# EAGLE design DOOM_SAO (EAGLE 9.3.2)
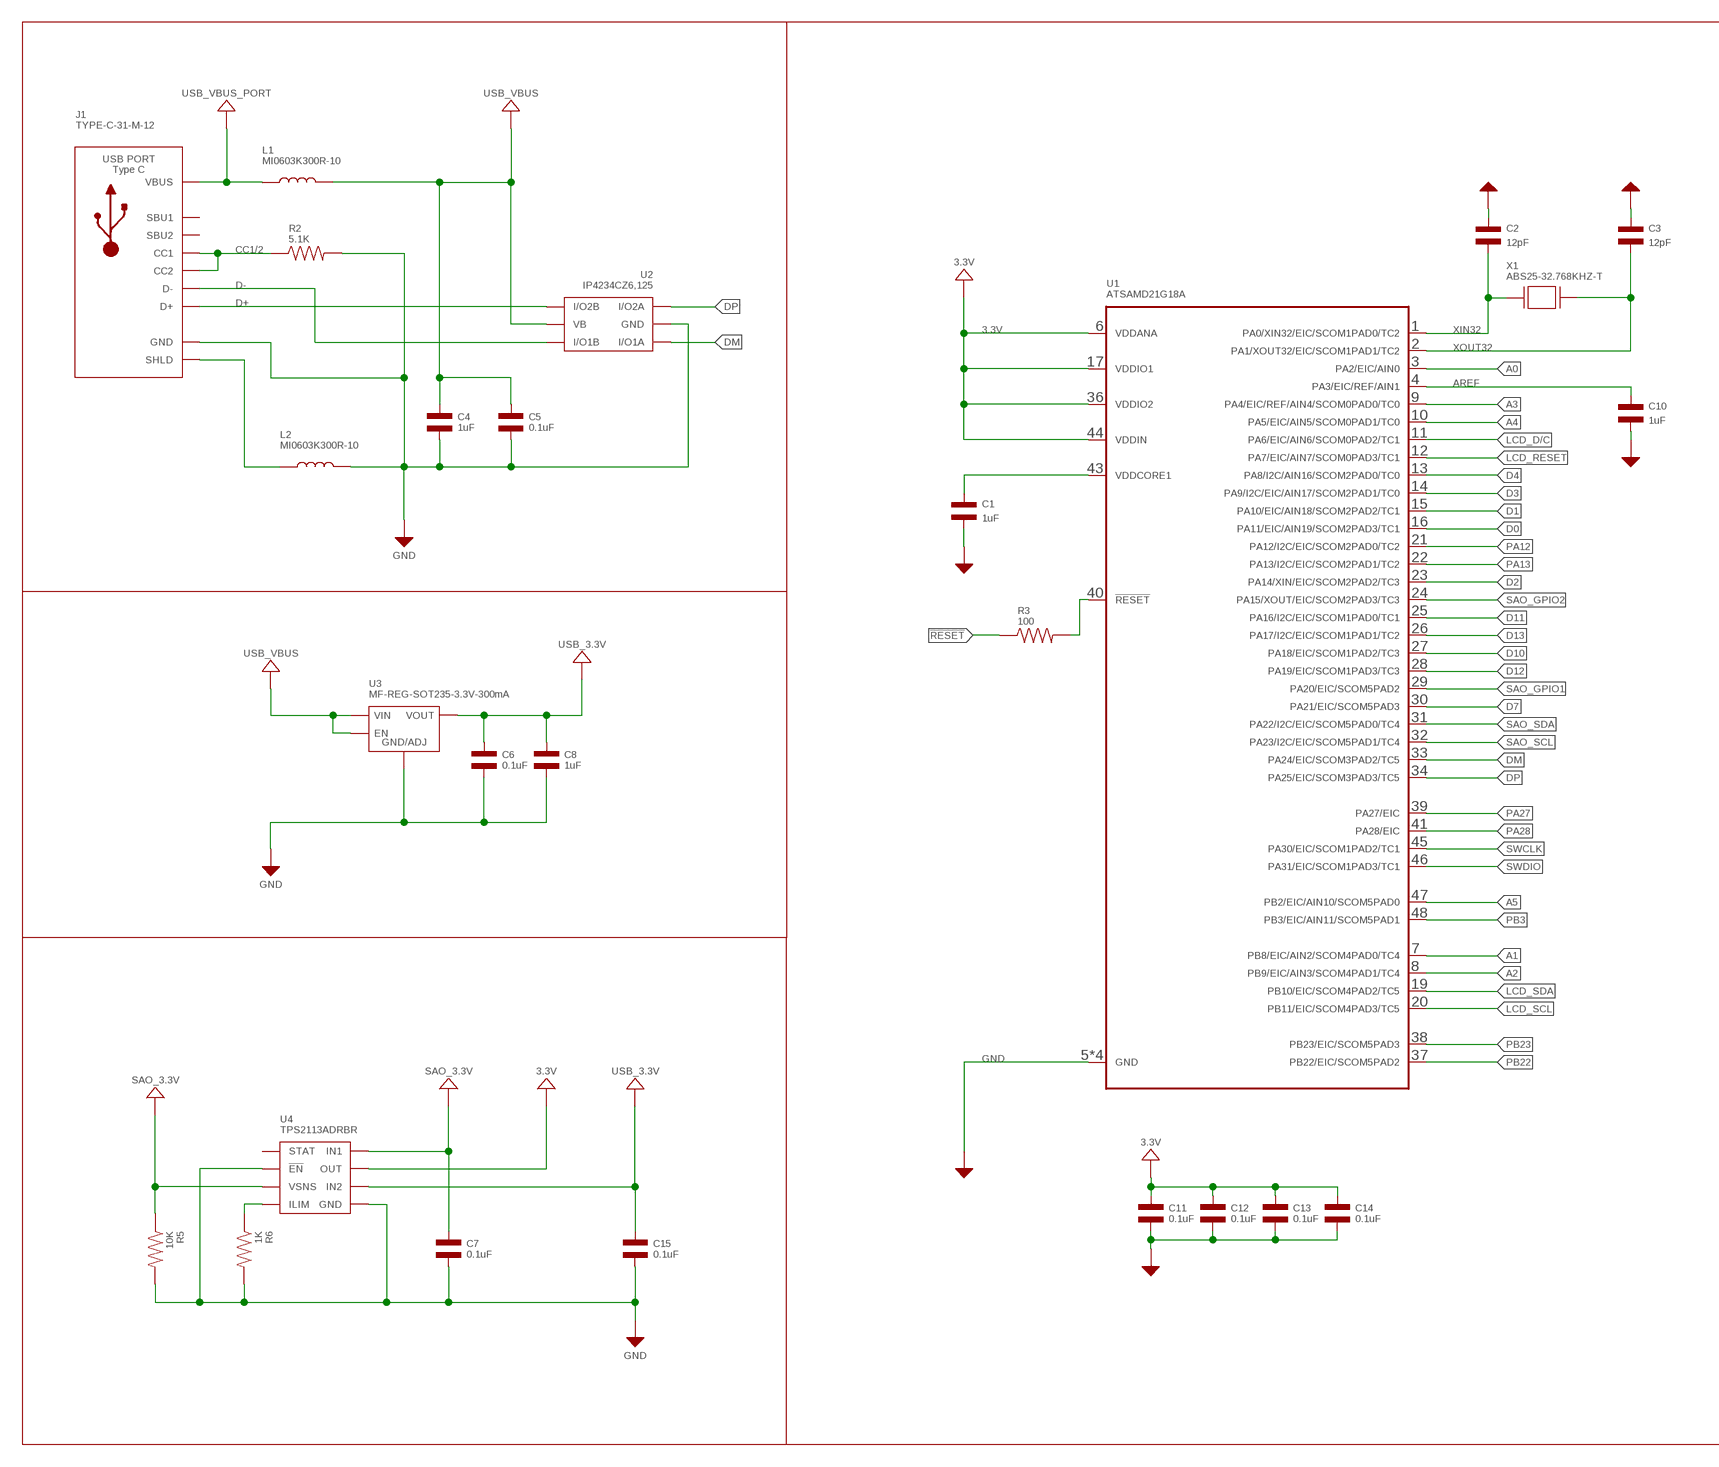
[diagram p0: schematic, sheet 1, part 1 of 2]
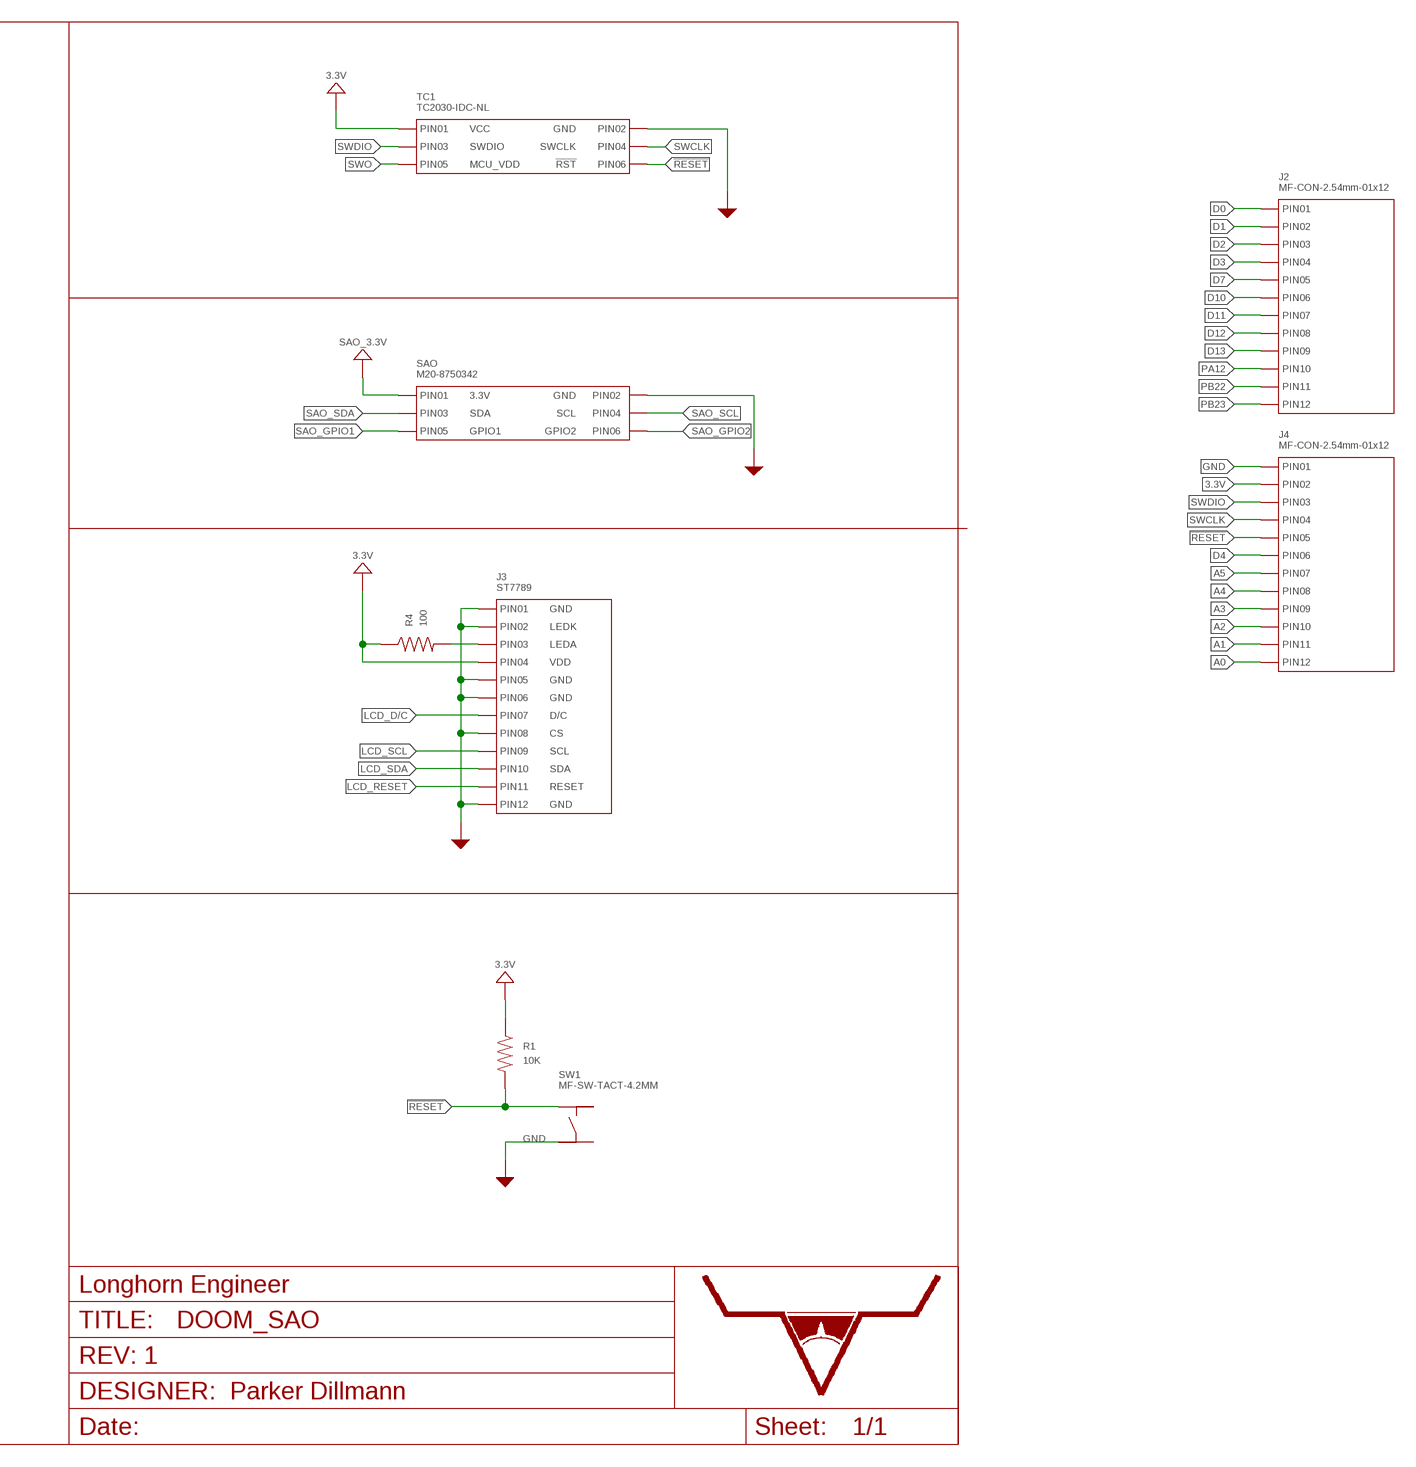
[diagram p1: schematic, sheet 1, part 2 of 2]

## Parts
C1  1uF  CAPACITOR_NP_0402  [C0402]
C2  12pF  CAPACITOR_NP_0402  [C0402]
C3  12pF  CAPACITOR_NP_0402  [C0402]
C4  1uF  CAPACITOR_NP_0402  [C0402]
C5  0.1uF  CAPACITOR_NP_0402  [C0402]
C6  0.1uF  CAPACITOR_NP_0402  [C0402]
C7  0.1uF  CAPACITOR_NP_0402  [C0402]
C8  1uF  CAPACITOR_NP_0402  [C0402]
C10  1uF  CAPACITOR_NP_0402  [C0402]
C11  0.1uF  CAPACITOR_NP_0402  [C0402]
C12  0.1uF  CAPACITOR_NP_0402  [C0402]
C13  0.1uF  CAPACITOR_NP_0402  [C0402]
C14  0.1uF  CAPACITOR_NP_0402  [C0402]
C15  0.1uF  CAPACITOR_NP_0402  [C0402]
J1  TYPE-C-31-M-12  USB_TYPE-C_MINIMAL  [TYPE-C-31-M-12]
J2  MF-CON-2.54mm-01x12  CON_01X12_PTH_2.54MM  [PTH_2.54MM_01X12]
J3  ST7789  CON_01X12_ST7789_CONNECTOR  [ST7789_CONNECTOR]
J4  MF-CON-2.54mm-01x12  CON_01X12_PTH_2.54MM  [PTH_2.54MM_01X12]
L1  MI0603K300R-10  INDUCTOR_0603  [L0603]
L2  MI0603K300R-10  INDUCTOR_0603  [L0603]
R1  10K  RESISTOR_0402  [R0402]
R2  5.1K  RESISTOR_0402  [R0402]
R3  100  RESISTOR_0402  [R0402]
R4  100  RESISTOR_0402  [R0402]
R5  10K  RESISTOR_0402  [R0402]
R6  1K  RESISTOR_0402  [R0402]
SAO  M20-8750342  CON_02X03_M20-8750342  [M20-8750342]
SW1  MF-SW-TACT-4.2MM  TACT_4.2MM  [TACT4.2MM]
TC1  TC2030-IDC-NL  CON_02X03_SWD2TC_TC2030-IDC-NL  [TC2030-IDC-NL]
U1  ATSAMD21G18A  ATSAMD21G18A-AU  [ATSAMD21G18A_TQFP-48]
U2  IP4234CZ6,125  IP4234CZ6  [IP4234CZ6_SOT-457-6]
U3  MF-REG-SOT235-3.3V-300mA  TLV70233PDBVR  [SOT-23-5]
U4  TPS2113ADRBR  TPS211(2/3)ADR  [TPS211X_SON-8]
U$8  LHE_FRAME  [LHE_FRAME]
X1  ABS25-32.768KHZ-T  CYRSTAL_ABS25  [ABS25_SERIES]

## Nets
3.3V: C11.P$1 C12.P$1 C13.P$1 C14.P$1 J3.P$4 J4.P$2(PIN2) R1.P$1 R4.P$1 TC1.P$1(PIN1) U1.6(VDDANA) U1.17(VDDIO1) U1.36(VDDIO2) U1.44(VDDIN) U4.7(OUT)
!RESET: J4.P$5(PIN5) R1.P$2 R3.P$1 SW1.P$1 TC1.P$6(PIN6)
A0: J4.P$12(PIN12) U1.3(PA2/EIC/AIN0)
A1: J4.P$11(PIN11) U1.7(PB8/EIC/AIN2/SCOM4PAD0/TC4)
A2: J4.P$10(PIN10) U1.8(PB9/EIC/AIN3/SCOM4PAD1/TC4)
A3: J4.P$9(PIN9) U1.9(PA4/EIC/REF/AIN4/SCOM0PAD0/TC0)
A4: J4.P$8(PIN8) U1.10(PA5/EIC/AIN5/SCOM0PAD1/TC0)
A5: J4.P$7(PIN7) U1.47(PB2/EIC/AIN10/SCOM5PAD0)
AREF: C10.P$1 U1.4(PA3/EIC/REF/AIN1)
BK_LIGHT: J3.P$3 R4.P$2
CC1/2: J1.A5(CC1) J1.B5(CC2) R2.P$1
D0: J2.P$1(PIN1) U1.16(PA11/EIC/AIN19/SCOM2PAD3/TC1)
D1: J2.P$2(PIN2) U1.15(PA10/EIC/AIN18/SCOM2PAD2/TC1)
D2: J2.P$3(PIN3) U1.23(PA14/XIN/EIC/SCOM2PAD2/TC3)
D3: J2.P$4(PIN4) U1.14(PA9/I2C/EIC/AIN17/SCOM2PAD1/TC0)
D4: J4.P$6(PIN6) U1.13(PA8/I2C/AIN16/SCOM2PAD0/TC0)
D7: J2.P$5(PIN5) U1.30(PA21/EIC/SCOM5PAD3)
D10: J2.P$6(PIN6) U1.27(PA18/EIC/SCOM1PAD2/TC3)
D11: J2.P$7(PIN7) U1.25(PA16/I2C/EIC/SCOM1PAD0/TC1)
D12: J2.P$8(PIN8) U1.28(PA19/EIC/SCOM1PAD3/TC3)
D13: J2.P$9(PIN9) U1.26(PA17/I2C/EIC/SCOM1PAD1/TC2)
D+: J1.A6(D+) J1.B6(D+) U2.4(I/O2B)
D-: J1.A7(D-) J1.B7(D-) U2.3(I/O1B)
DM: U1.33(PA24/EIC/SCOM3PAD2/TC5) U2.1(I/O1A)
DP: U1.34(PA25/EIC/SCOM3PAD3/TC5) U2.6(I/O2A)
GND: C1.P$2 C2.P$1 C3.P$1 C4.P$2 C5.P$2 C6.P$2 C7.P$2 C8.P$2 C10.P$2 C11.P$2 C12.P$2 C13.P$2 C14.P$2 C15.P$2 J1.A1/B12(GND) J1.B1/A12(GND) J3.P$1 J3.P$2 J3.P$5 J3.P$6 J3.P$8 J3.P$12 J4.P$1(PIN1) L2.P$2 R2.P$2 R5.P$2 R6.P$2 SAO.2(PIN2) SW1.P$3 TC1.P$2(PIN2) U1.5(GND) U1.18(GND) U1.35(GND) U1.42(GND) U2.2(GND) U3.P$2(GND/ADJ) U4.2(!EN) U4.5(GND) U4.PAD(GND)
LCD_D/C: J3.P$7 U1.11(PA6/EIC/AIN6/SCOM0PAD2/TC1)
LCD_RESET: J3.P$11 U1.12(PA7/EIC/AIN7/SCOM0PAD3/TC1)
LCD_SCL: J3.P$9 U1.20(PB11/EIC/SCOM4PAD3/TC5)
LCD_SDA: J3.P$10 U1.19(PB10/EIC/SCOM4PAD2/TC5)
PA12: J2.P$10(PIN10) U1.21(PA12/I2C/EIC/SCOM2PAD0/TC2)
PA13: U1.22(PA13/I2C/EIC/SCOM2PAD1/TC2)
PA27: U1.39(PA27/EIC)
PA28: U1.41(PA28/EIC)
PB3: U1.48(PB3/EIC/AIN11/SCOM5PAD1)
PB22: J2.P$11(PIN11) U1.37(PB22/EIC/SCOM5PAD2)
PB23: J2.P$12(PIN12) U1.38(PB23/EIC/SCOM5PAD3)
RESETLIN: R3.P$2 U1.40(!RESET)
SAO_3.3V: C7.P$1 R5.P$1 SAO.1(PIN1) U4.3(VSNS) U4.8(IN1)
SAO_GPIO1: SAO.5(PIN5) U1.29(PA20/EIC/SCOM5PAD2)
SAO_GPIO2: SAO.6(PIN6) U1.24(PA15/XOUT/EIC/SCOM2PAD3/TC3)
SAO_SCL: SAO.4(PIN4) U1.32(PA23/I2C/EIC/SCOM5PAD1/TC4)
SAO_SDA: SAO.3(PIN3) U1.31(PA22/I2C/EIC/SCOM5PAD0/TC4)
SHLD: J1.MT_B_0(SHLD) J1.MT_B_1(SHLD) J1.MT_B_2(SHLD) J1.MT_B_3(SHLD) J1.MT_T_0(SHLD) J1.MT_T_1(SHLD) J1.MT_T_2(SHLD) J1.MT_T_3(SHLD) L2.P$1
SWCLK: J4.P$4(PIN4) TC1.P$4(PIN4) U1.45(PA30/EIC/SCOM1PAD2/TC1)
SWDIO: J4.P$3(PIN3) TC1.P$3(PIN3) U1.46(PA31/EIC/SCOM1PAD3/TC1)
SWO: TC1.P$5(PIN5)
TPS_ILIM: R6.P$1 U4.4(ILIM)
USB_3.3V: C6.P$1 C8.P$1 C15.P$1 U3.P$5(VOUT) U4.6(IN2)
USB_VBUS: C4.P$1 C5.P$1 L1.P$2 U2.5(VB) U3.P$1(VIN) U3.P$3(EN)
USB_VBUS_PORT: J1.A4/B9(VBUS) J1.B4/A9(VBUS) L1.P$1
VDDCORE: C1.P$1 U1.43(VDDCORE1)
XIN32: C2.P$2 U1.1(PA0/XIN32/EIC/SCOM1PAD0/TC2) X1.1(X0)
XOUT32: C3.P$2 U1.2(PA1/XOUT32/EIC/SCOM1PAD1/TC2) X1.4(X1)
Unconnected: J1.A8(SBU1) J1.B8(SBU2) SW1.P$2 SW1.P$4 U4.1(STAT)

## Library data of the parts
C1 C4 C8 C10 = MF_Passives:CAPACITOR_NP: Library: MF_Passives Description: Device for Non-Polarized Capacitors. Manufacture part number (MPN) can be added via Attributes. Check https://factory.macrofab.com/parts for the house parts list.; MPN: MF-CAP-0402-1uF; POPULATE: 1
C2 C3 = MF_Passives:CAPACITOR_NP: Library: MF_Passives Description: Device for Non-Polarized Capacitors. Manufacture part number (MPN) can be added via Attributes. Check https://factory.macrofab.com/parts for the house parts list.; MPN: CC0402JRNPO9BN120; POPULATE: 1
C5-C7 C11-C15 = MF_Passives:CAPACITOR_NP: Library: MF_Passives Description: Device for Non-Polarized Capacitors. Manufacture part number (MPN) can be added via Attributes. Check https://factory.macrofab.com/parts for the house parts list.; MPN: MF-CAP-0402-0.1uF; POPULATE: 1
J1 = PP_Connectors:USB_TYPE-C_MINIMAL; MPN: TYPE-C-31-M-12; POPULATE: 1
J2 J4 = MF_Connectors:CON_01X12: Library: MF_Connectors Description: Header Connector with 12 Positions and 01 Rows. Use the LABEL Attribute to label the pin on the schematic and PCB. You can remove the attributes on the PCB by using the SMASH function on the part and then deleting the text.; HOUSEPART: YES; MPN: MF-CON-2.54mm-01x12; POPULATE: 1; URL: https://factory.macrofab.com/part/MF-CON-2.54mm-01x12
J3 = PP_Connectors:CON_01X12; LABEL01: GND; LABEL02: LEDK; LABEL03: LEDA; LABEL04: VDD; LABEL05: GND; LABEL06: GND; LABEL07: D/C; LABEL08: CS; LABEL09: SCL; LABEL10: SDA; LABEL11: RESET; LABEL12: GND; POPULATE: 0
L1 L2 = MF_Passives:INDUCTOR: Library: MF_Passives Description: Device for Inductors. Manufacture part number (MPN) can be added via Attributes. Check https://factory.macrofab.com/parts for the house parts list.; MPN: MI0603K300R-10; POPULATE: 1
R1 R5 = MF_Passives:RESISTOR: Library: MF_Passives Description: Device for Resistors. Manufacture part number (MPN), Voltage, Tolerance, and Wattage Rating can be added via Attributes. Check https://factory.macrofab.com/parts for the house parts list.; MPN: MF-RES-0402-10K; POPULATE: 1
R2 = MF_Passives:RESISTOR: Library: MF_Passives Description: Device for Resistors. Manufacture part number (MPN), Voltage, Tolerance, and Wattage Rating can be added via Attributes. Check https://factory.macrofab.com/parts for the house parts list.; MPN: ERJ-2RHD5101X; POPULATE: 1
R3 R4 = MF_Passives:RESISTOR: Library: MF_Passives Description: Device for Resistors. Manufacture part number (MPN), Voltage, Tolerance, and Wattage Rating can be added via Attributes. Check https://factory.macrofab.com/parts for the house parts list.; MPN: MF-RES-0402-100; POPULATE: 1
R6 = MF_Passives:RESISTOR: Library: MF_Passives Description: Device for Resistors. Manufacture part number (MPN), Voltage, Tolerance, and Wattage Rating can be added via Attributes. Check https://factory.macrofab.com/parts for the house parts list.; MPN: MF-RES-0402-1K; POPULATE: 1
SAO = PP_Connectors:CON_02X03; LABEL01: 3.3V; LABEL02: GND; LABEL03: SDA; LABEL04: SCL; LABEL05: GPIO1; LABEL06: GPIO2; MPN: M20-8750342; POPULATE: 1
SW1 = MF_Switches:TACT: Library: MF_Switches Description: Device for Tact Switches. Manufacture part number (MFG#) can be added via Attributes.; HOUSEPART: YES; MPN: MF-SW-TACT-4.2MM; POPULATE: 1; URL: https://factory.macrofab.com/part/MF-SW-TACT-4.2MM
TC1 = MF_Connectors:CON_02X03: Library: MF_Connectors Description: Header Connector with 6 Positions and 02 Rows. Use the LABEL Attribute to label the pin on the schematic and PCB. You can remove the attributes on the PCB by using the SMASH function on the part and then deleting the text.; HOUSEPART: NO; LABEL01: VCC; LABEL02: GND; LABEL03: SWDIO; LABEL04: SWCLK; LABEL05: MCU_VDD; LABEL06: !RST; MPN: TC2030-IDC-NL; POPULATE: 0; URL: http://www.tag-connect.com/TC2030-IDC-NL
U1 = PP_DigitalIC:ATSAMD21G18A; MPN: ATSAMD21G18A-AU; POPULATE: 1
U2 = PP_Passives:IP4234CZ6: Mouser Part #: 771-IP4234CZ6125 Manufacturer Part #: IP4234CZ6,125 Manufacturer: NXP Semiconductors Description: ESD Suppressors Single USB 2.0 ESD Protection 6-Pin http://www.mouser.com/ProductDetail/NXP-Semiconductors/IP4234CZ6125/?qs=sGAEpiMZZMvxHShE6Whpu7QUdHOfUl1T0xbl582qhFk%3d; MPN: IP4234CZ6,125; POPULATE: 1
U3 = MF_IC_Power:TLV702: Manufacturer Part #: TLV702 Manufacturer: Texas Instruments Description: LDO Voltage Regulators; HOUSEPART: YES; MPN: MF-REG-SOT235-3.3V-300mA; POPULATE: 1; URL: https://factory.macrofab.com/part/MF-REG-SOT235-3.3V-300mA
U4 = PP_PowerIC:TPS211(2/3): Manufacturer Part #: TPS2112 / TPS2113 Manufacturer: Texas Instruments Description: Power Switch ICs - Power Distribution Autoswitching Power Mux
U$8 = PP_Aesthetics:LHE_FRAME; DNAME: Parker Dillmann; POPULATE: 0; REVNUM: REV: 1
X1 = MF_Frequency_Control:CYRSTAL: Library: MF_Frequency_Control Description: Device for two functional pin Cyrstal Oscillators.; HOUSEPART: NO; MPN: ABS25-32.768KHZ-T; POPULATE: 1; URL: http://www.abracon.com/Resonators/abs25.pdf

## Board
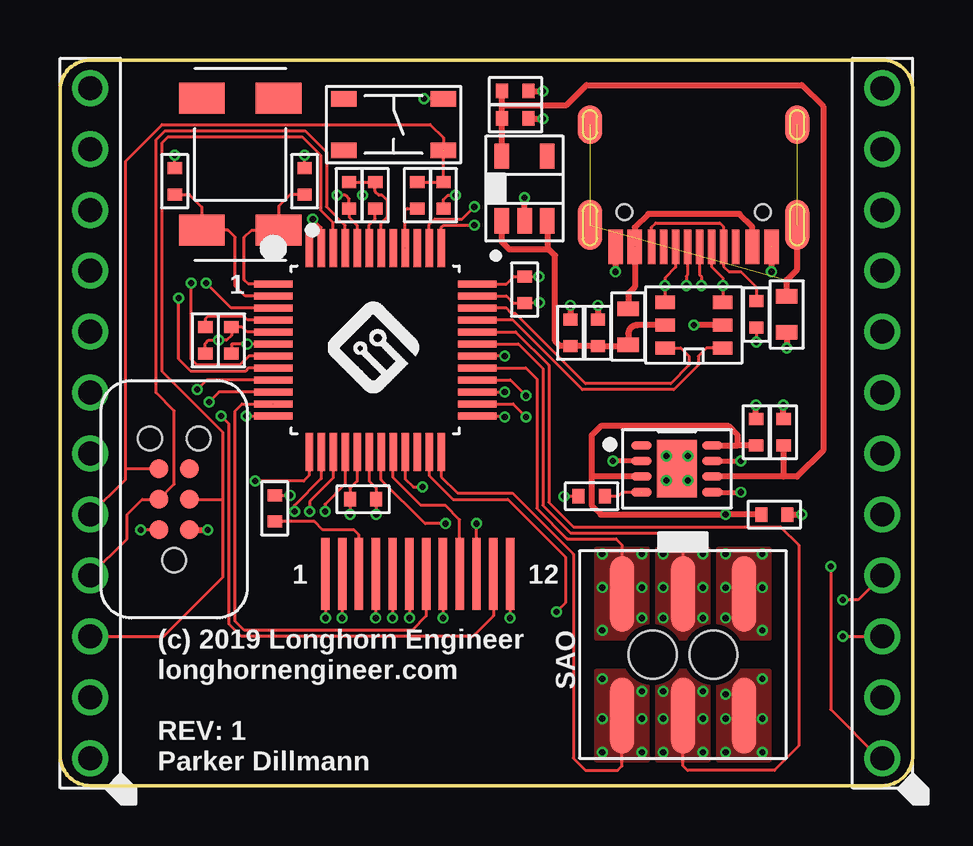
[diagram p2: board, top side]
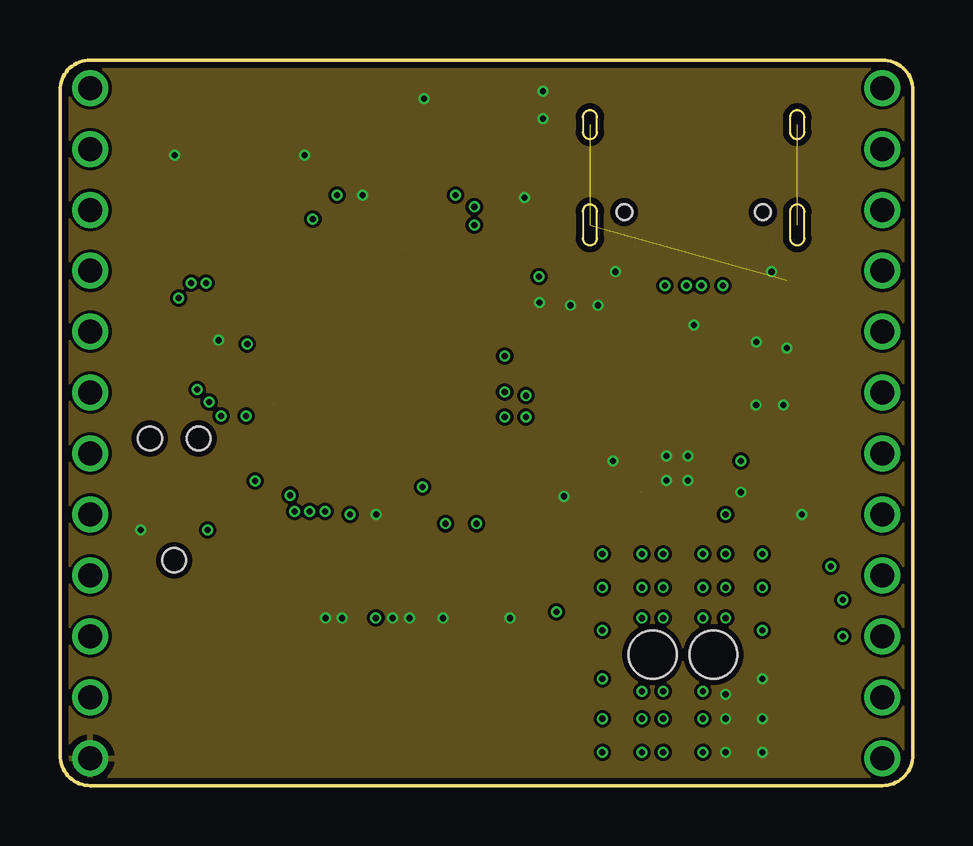
[diagram p3: board, inner layer Route2]
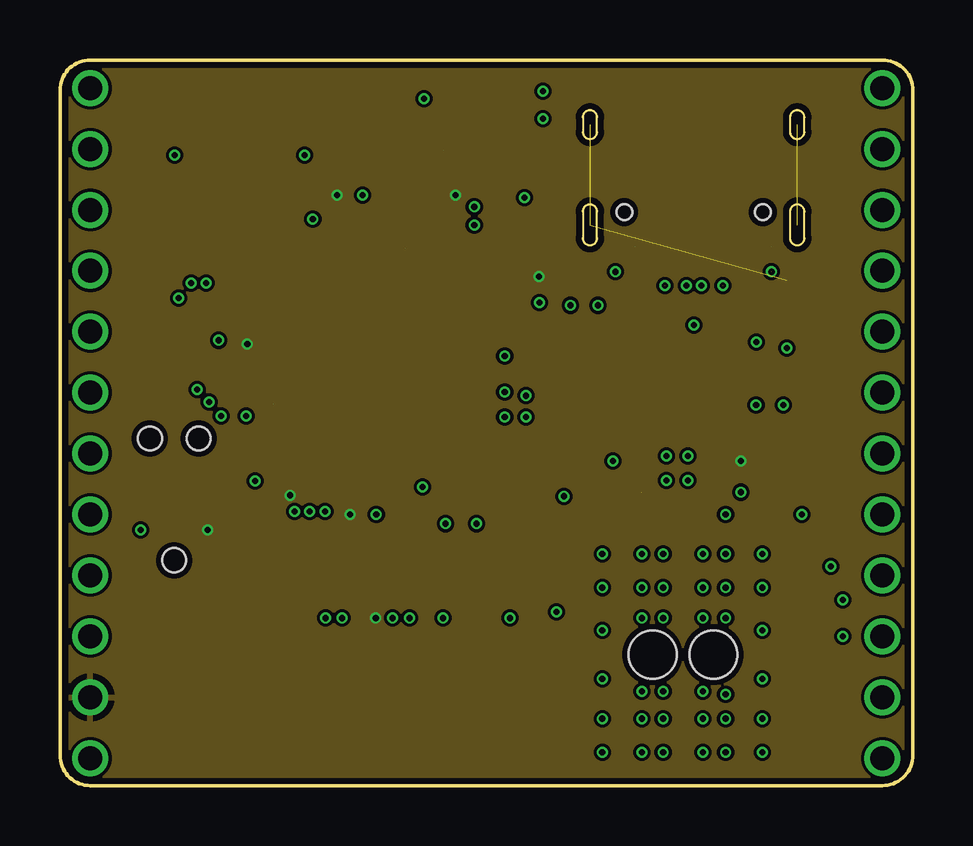
[diagram p4: board, inner layer Route15]
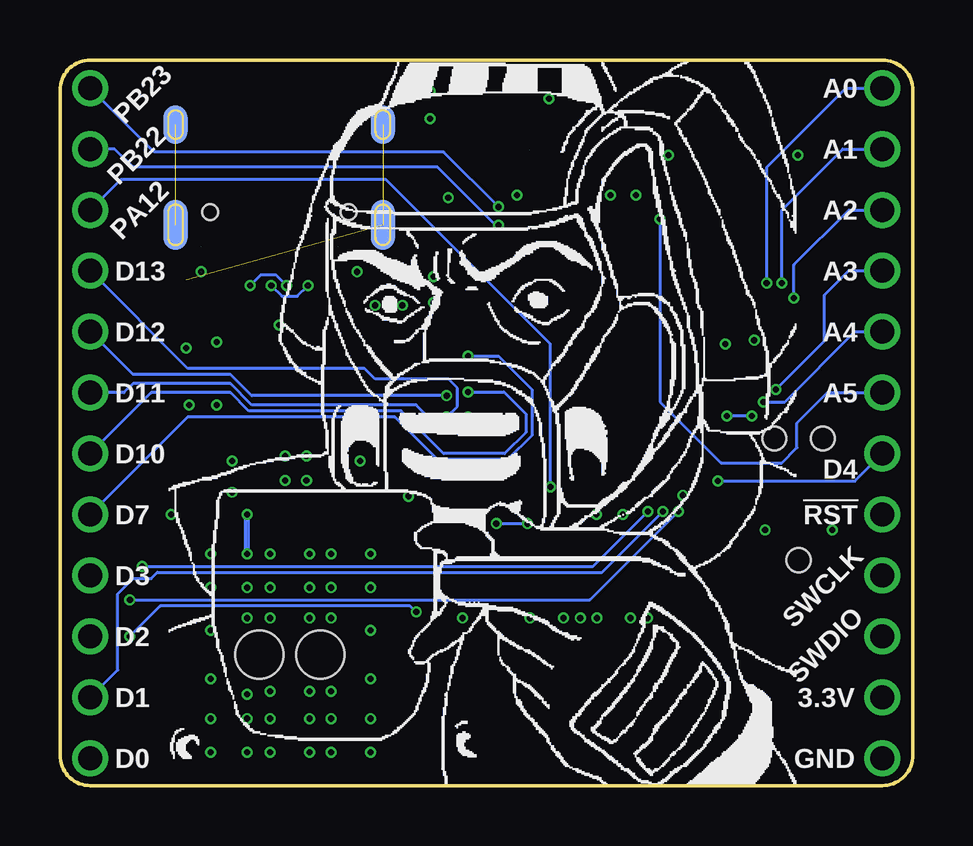
[diagram p5: board, bottom side, seen from below]

Size 35.55 x 30.25 mm. Coordinates in mm from the lower left corner, seen from the top.
Outline: 0,28.98 0,1.27 arc90 1.27,0 34.28,0 arc90 35.55,1.27 35.55,28.98 arc90 34.28,30.25 1.27,30.25 arc90 0,28.98
Copper layers (1*2*15*16): Top 0.035mm / dielectric 0.23mm / Route2 0.035mm / dielectric 0.93mm / Route15 0.035mm / dielectric 0.23mm / Bottom 0.035mm
Design rules "MF_Standard_4_Layer": minimum track width 5mil, minimum drill 10mil, track to track 5mil, track to pad 5mil, pad to pad 5mil, via to via 5mil, smd to smd 0mil, copper to edge 10mil, drill to drill 10mil, minimum pad ring 4mil, minimum via ring 4mil, stop-mask expansion 2mil, vias tented up to drill 25mil, thermal gap 10mil

### Footprints (pad centres in the part's own frame; a part is rotated, then mirrored left to right if it is on the bottom)
C0402 = smd 0.5 x 0.6: P$1 -0.55,0; P$2 0.55,0
TYPE-C-31-M-12 = smd 0.6 x 1.45: A1/B12 -3.25,5.095; A4/B9 -2.45,5.095; B1/A12 3.25,5.095; B4/A9 2.45,5.095 | smd 0.3 x 1.45: A5 -1.25,5.095; A6 -0.25,5.095; A7 0.25,5.095; A8 1.25,5.095; B5 1.75,5.095; B6 0.75,5.095; B7 -0.75,5.095; B8 -1.75,5.095 | smd 1 x 2.1 bottom: MT_B_0 -4.32,4.18; MT_B_1 4.32,4.18 | smd 1 x 1.6 bottom: MT_B_2 -4.32,0; MT_B_3 4.32,0 | smd 1 x 2.1: MT_T_0 -4.32,4.18; MT_T_1 4.32,4.18 | smd 1 x 1.6: MT_T_2 -4.32,0; MT_T_3 4.32,0 | hole 0.65: -2.89,3.65; 2.89,3.65
PTH_2.54MM_01X12 = drill 1: P$1 -13.97,0; P$2 -11.43,0; P$3 -8.89,0; P$4 -6.35,0; P$5 -3.81,0; P$6 -1.27,0; P$7 1.27,0; P$8 3.81,0; P$9 6.35,0; P$10 8.89,0; P$11 11.43,0; P$12 13.97,0
ST7789_CONNECTOR = smd 0.35 x 3: P$1 -3.85,0; P$2 -3.15,0; P$3 -2.45,0; P$4 -1.75,0; P$5 -1.05,0; P$6 -0.35,0; P$7 0.35,0; P$8 1.05,0; P$9 1.75,0; P$10 2.45,0; P$11 3.15,0; P$12 3.85,0
L0603 = smd 0.6 x 0.9: P$1 -0.75,0; P$2 0.75,0
R0402 = smd 0.5 x 0.6: P$1 -0.55,0; P$2 0.55,0
M20-8750342 = smd 1 x 3.15: 1 -2.54,-2.54; 2 -2.54,2.54; 3 0,-2.54; 4 0,2.54; 5 2.54,-2.54; 6 2.54,2.54 | hole 2: -1.27,0; 1.27,0
TACT4.2MM = smd 1.05 x 0.65: P$1 -2.075,1.075; P$2 2.075,1.075; P$3 -2.075,-1.075; P$4 2.075,-1.075
TC2030-IDC-NL = smd 0.787 x 0.787: P$1 -1.27,-0.635; P$2 -1.27,0.635; P$3 0,-0.635; P$4 0,0.635; P$5 1.27,-0.635; P$6 1.27,0.635 | hole 0.991: 2.54,1.016; 2.54,-1.016; -2.54,0
ATSAMD21G18A_TQFP-48 = smd 1.6 x 0.3: 1 -4.25,2.75; 2 -4.25,2.25; 3 -4.25,1.75; 4 -4.25,1.25; 5 -4.25,0.75; 6 -4.25,0.25; 7 -4.25,-0.25; 8 -4.25,-0.75; 9 -4.25,-1.25; 10 -4.25,-1.75; 11 -4.25,-2.25; 12 -4.25,-2.75; 25 4.25,-2.75; 26 4.25,-2.25; 27 4.25,-1.75; 28 4.25,-1.25; 29 4.25,-0.75; 30 4.25,-0.25; 31 4.25,0.25; 32 4.25,0.75; 33 4.25,1.25; 34 4.25,1.75; 35 4.25,2.25; 36 4.25,2.75 | smd 0.3 x 1.6: 13 -2.75,-4.25; 14 -2.25,-4.25; 15 -1.75,-4.25; 16 -1.25,-4.25; 17 -0.75,-4.25; 18 -0.25,-4.25; 19 0.25,-4.25; 20 0.75,-4.25; 21 1.25,-4.25; 22 1.75,-4.25; 23 2.25,-4.25; 24 2.75,-4.25; 37 2.75,4.25; 38 2.25,4.25; 39 1.75,4.25; 40 1.25,4.25; 41 0.75,4.25; 42 0.25,4.25; 43 -0.25,4.25; 44 -0.75,4.25; 45 -1.25,4.25; 46 -1.75,4.25; 47 -2.25,4.25; 48 -2.75,4.25
IP4234CZ6_SOT-457-6 = smd 0.8 x 0.55: 1 -1.2,0.95; 2 -1.2,0; 3 -1.2,-0.95; 4 1.2,-0.95; 5 1.2,0; 6 1.2,0.95
SOT-23-5 = smd 1.05 x 0.6: P$1 -1.35,0.95; P$2 -1.35,0; P$3 -1.35,-0.95; P$4 1.35,-0.95; P$5 1.35,0.95
TPS211X_SON-8 = smd 0.35 x 0.85: 1 -0.975,-1.475; 2 -0.325,-1.475; 3 0.325,-1.475; 4 0.975,-1.475; 5 0.975,1.475; 6 0.325,1.475; 7 -0.325,1.475; 8 -0.975,1.475 | smd 2.4 x 1.65: PAD 0,0
ABS25_SERIES = smd 1.9 x 1.3: 1 -1.6,2.75; 2 -1.6,-2.75; 3 1.6,-2.75; 4 1.6,2.75

### Placement (x,y rotation side)
C1  13.14,24.61 90 top
C2  10.2,25.2 270 top
C3  4.79,25.2 270 top
C4  21.28,18.88 90 top
C5  22.43,18.88 90 top
C6  18.99,27.81 0 top
C7  29.02,14.73 90 top
C8  18.99,28.96 0 top
C10  6.06,18.57 270 top
C11  7.15,18.57 90 top
C12  12.64,11.94 0 top
C13  19.37,20.68 270 top
C14  12.05,24.61 90 top
C15  30.16,14.73 90 top
J1  26.41,27.56 180 top
J2  34.29,15.11 90 top
J3  14.92,8.83 0 top
J4  1.27,15.11 90 top
L1  23.7,19.14 270 top
L2  30.3,19.64 270 top
R1  15.99,24.61 90 top
R2  29.03,19.64 270 top
R3  14.9,24.61 270 top
R4  8.95,11.56 270 top
R5  29.78,11.3 0 top
R6  22.16,12.06 180 top
SAO  25.97,5.46 180 top
SW1  13.91,27.56 180 top
TC1  4.76,11.94 90 top
U1  13.14,18.16 0 top
U2  26.43,19.2 180 top
U3  19.37,24.89 90 top
U4  25.72,13.21 270 top
U$8  4.06,0.64 0 top
U$9  [MF_LOGO_SMALL]  11.18,16.38 0 top
X1  7.52,25.91 180 top

### Tracks (layer width: path | path; a pad name or v marks a point on that pad's centre or on a via)
3.3V  (via drill 0.25)
  Top 0.127: U1.17 12.39,12.7 12.09,12.39 C12.P$1 v12.09,11.3 | U1.36 18.61,20.91 18.92,21.23 C13.P$1 v19.98,21.23 | U1.44 12.39,23.36 12.05,23.7 C14.P$1 12.05,24.46 11.9,24.61 v11.54,24.61 | R1.P$1 15.99,24.43 16.17,24.61 v16.5,24.61 | U1.6 v7.81,18.41 7.18,18.41 7.15,18.39 C11.P$1 | J3.P$4 v13.17,6.99 | R4.P$1 v9.59,12.11
  Top 0.2: U4.7 v28.38,13.53
  Top 0.254: TC1.P$1 v6.16,10.67
  pour Route15: 0,1.27 0,28.98 arc-90 1.27,30.25 34.28,30.25 arc-90 35.55,28.98 35.55,1.27 arc-90 34.28,0 1.27,0 arc-90
!RESET  (1 unrouted)
  Top 0.127: R3.P$1 R1.P$2 SW1.P$1 15.98,27.01 15.43,27.56 4.25,27.56 2.73,26.04 2.73,13.21 | J4.P$5 2.73,12.76 2.73,13.21 | TC1.P$6 2.73,13.21
A0  (via drill 0.25)
  Top 0.127: U1.3 7.14,19.91 v6.1,20.95
  Bottom 0.127: v6.1,20.95 6.1,25.78 2.79,29.08 J4.P$12
A1  (via drill 0.25)
  Top 0.127: U1.7 7.88,17.91 7.49,17.53 5.71,17.53 5.46,17.78 v5.46,20.95
  Bottom 0.127: v5.46,20.95 5.46,24 2.92,26.54 J4.P$11
A2  (via drill 0.25)
  Top 0.127: U1.8 7.87,17.41 7.74,17.27 5.46,17.27 4.95,17.78 v4.95,20.32
  Bottom 0.127: v4.95,20.32 4.95,21.72 2.67,24 J4.P$10
A3  (via drill 0.25)
  Top 0.127: U1.9 6.12,16.91 v5.71,16.51
  Bottom 0.127: v5.71,16.51 3.68,18.54 3.68,20.45 2.67,21.46 J4.P$9
A4  (via drill 0.25)
  Top 0.127: U1.10 6.63,16.41 v6.22,16
  Bottom 0.127: v6.22,16 5.33,16 2.41,18.92 J4.P$8
A5  (via drill 0.25)
  Top 0.127: U1.47 10.89,23.27 v10.54,23.62
  Bottom 0.127: v10.54,23.62 10.54,16 8,13.46 5.46,13.46 4.83,14.1 4.83,15.11 3.56,16.38 J4.P$7
AREF
  Top 0.127: U1.4 7.83,19.41 7.68,19.56 6.16,19.56 6.06,19.46 C10.P$1
BK_LIGHT
  Top 0.127: J3.P$3 12.47,10.46 12.26,10.67 10.94,10.67 10.6,11.01 R4.P$2
CC1/2
  Top 0.127: J1.B5 24.66,23.28 24.84,23.45 27.51,23.45 27.66,23.3 J1.A5 27.66,21.64 27.89,21.42 28.39,21.42 29.03,20.79 R2.P$1
D0  (via drill 0.25)
  Top 0.127: U1.16 11.89,12.57 11.05,11.73 v11.05,11.43 | v32.13,9.14 32.13,3.17 34.16,1.14 J2.P$1
  Bottom 0.127: v32.13,9.14 13.34,9.14 v11.05,11.43
D1  (via drill 0.25)
  Top 0.127: U1.15 11.39,12.83 10.41,11.85 v10.41,11.43
  Bottom 0.127: J2.P$2 33.15,4.83 33.15,8 32.51,8.64 31.75,8.64 31.5,8.89 12.95,8.89 v10.41,11.43
D2  (via drill 0.25)
  Top 0.127: U1.23 15.39,12.93 16.38,11.94 18.67,11.94 21.08,9.53 21.08,7.62 v20.7,7.24 | v32.64,6.22 J2.P$3
  Bottom 0.127: v20.7,7.24 20.95,7.49 31.37,7.49 v32.64,6.22
D3  (via drill 0.25)
  Top 0.127: U1.14 10.89,12.8 9.78,11.68 v9.78,11.43 | J2.P$4 33.27,7.75 v32.64,7.75
  Bottom 0.127: v32.64,7.75 13.46,7.75 v9.78,11.43
D4  (via drill 0.25)
  Top 0.127: U1.13 10.39,12.93 10.16,12.7 v8.13,12.7
  Bottom 0.127: v8.13,12.7 2.41,12.7 J4.P$6
D7  (via drill 0.25)
  Top 0.127: v18.54,17.91 U1.30
  Bottom 0.127: v18.54,17.91 17.27,17.91 15.88,16.51 15.88,14.61 16.89,13.59 19.81,13.59 21.59,15.37 30.23,15.37 J2.P$5
D10  (via drill 0.25)
  Top 0.127: U1.27 v18.54,16.41
  Bottom 0.127: v18.54,16.41 17.05,16.41 16.13,15.49 16.13,14.73 17.02,13.84 19.56,13.84 21.34,15.62 27.69,15.62 28.45,16.38 31.75,16.38 J2.P$6
D11  (via drill 0.25)
  Top 0.127: U1.25 18.54,15.41 v18.54,15.37
  Bottom 0.127: v18.54,15.37 19.05,14.86 19.68,14.86 20.7,15.88 27.56,15.88 28.45,16.76 32.51,16.76 32.89,16.38 J2.P$7
D12  (via drill 0.25)
  Top 0.127: U1.28 18.78,16.91 v19.43,16.26
  Bottom 0.127: v19.43,16.26 27.56,16.26 28.45,17.14 32.51,17.14 J2.P$8
D13  (via drill 0.25)
  Top 0.127: U1.26 18.89,15.91 v19.43,15.37
  Bottom 0.127: v19.43,15.37 18.99,15.81 18.99,16.57 19.37,16.95 22.42,16.95 22.86,17.4 30.23,17.4 J2.P$9
D+  (via drill 0.25)  (1 unrouted)
  Top 0.127: J1.B6 25.66,21.61 25.22,21.17 v25.22,20.85 U2.4 | J1.A6 26.66,21.3 26.74,21.21 v26.74,20.85
  Bottom 0.127: v26.74,20.85 26.3,20.41 25.66,20.41 v25.22,20.85
D-  (via drill 0.25)  (1 unrouted)
  Top 0.127: J1.B7 27.16,21.64 27.63,21.17 v27.63,20.85 U2.3 | J1.A7 26.16,21.3 26.11,21.24 v26.11,20.85
  Bottom 0.127: v26.11,20.85 26.55,21.3 27.19,21.3 v27.63,20.85
DM
  Top 0.127: U2.1 26.95,18.25 26.61,17.91 26.61,17.53 25.59,16.51 21.78,16.51 18.88,19.41 U1.33
DP
  Top 0.127: U2.6 25.88,18.25 26.23,17.91 26.23,17.53 25.46,16.76 21.91,16.76 18.99,19.68 18.83,19.68 18.61,19.91 U1.34
GND  (via drill 0.25)  (2 unrouted)
  Top 0.127: R2.P$2 v29.03,18.5 | U1.5 7.81,18.91 7.6,19.12 C11.P$2 7.15,18.77 6.95,18.57 v6.62,18.57 6.18,18.57 6.06,18.44 C10.P$2 | U1.18 12.89,12.7 13.19,12.41 C12.P$2 v13.19,11.3 | U1.35 18.61,20.41 18.89,20.13 C13.P$2 v19.99,20.13 | U1.42 13.39,23.47 13.65,23.73 13.65,24.38 13.42,24.61 13.3,24.61 13.14,24.77 C1.P$2 12.61,25.16 | C14.P$2 12.61,25.16 | R6.P$2 v21.02,12.06 | C2.P$1 v10.2,26.29 | 12.61,25.16 v12.61,24.61 | C3.P$1 v4.79,26.29 | J3.P$2 v11.77,6.99 | J3.P$1 v11.07,6.99 | J3.P$5 v13.87,6.99 | J3.P$6 v14.57,6.99 | J3.P$8 v15.97,6.99 | J3.P$12 v18.77,6.99 | SW1.P$3 v15.18,28.63 | TC1.P$2 v3.37,10.67 | U4.PAD 25.28,13.21 v25.28,12.72
  Top 0.2: U4.2 v23.05,13.53 | U4.5 v28.38,12.23
  Top 0.254: L2.P$2 v30.3,18.25 | v22.43,20.02 C5.P$2 | v21.28,20.02 C4.P$2 | U2.2 v26.43,19.2 | J1.A1/B12 v29.66,21.42 | J1.B1/A12 v23.16,21.42 | U3.P$2 v19.37,24.51 | C6.P$2 v20.13,27.81 | C8.P$2 v20.13,28.96 | C15.P$2 v30.16,15.88 | C7.P$2 v29.02,15.88 | R5.P$2 v30.92,11.3
  other vias: 25.28,13.74 26.17,13.74 26.17,12.72 29.27,2.79 29.27,4.45 27.75,3.81 27.75,2.79 27.75,1.4 29.27,1.4
  pour Route2: 0,1.27 0,28.98 arc-90 1.27,30.25 34.28,30.25 arc-90 35.55,28.98 35.55,1.27 arc-90 34.28,0 1.27,0 arc-90
  pour Top (no thermals): 27.43,4.83 29.59,4.83 29.59,1.02 27.43,1.02
LCD_D/C  (1 unrouted)
  Top 0.127: J3.P$7 15.27,7.07 14.67,6.48 7.68,6.48 7.3,6.86 7.3,15.62 7.59,15.91 U1.11
LCD_RESET  (via drill 0.25)
  Top 0.127: J3.P$11 18.07,7.08 17.21,6.22 7.56,6.22 7.05,6.73 7.05,15.08 v6.72,15.41 | v7.76,15.41 U1.12
  Bottom 0.127: v6.72,15.41 v7.76,15.41
LCD_SCL
  Top 0.127: J3.P$9 16.67,11.08 16.07,11.68 15.05,11.68 13.89,12.84 U1.20
LCD_SDA  (via drill 0.25)
  Top 0.127: J3.P$10 v17.37,10.92 | v16.07,10.92 15.22,10.92 13.39,12.75 U1.19
  Bottom 0.127: v17.37,10.92 v16.07,10.92
PA12  (via drill 0.25)
  Top 0.127: U1.21 14.39,12.78 14.73,12.45 v15.11,12.45
  Bottom 0.127: v15.11,12.45 15.11,18.41 21.97,25.27 33.02,25.27 J2.P$10
PB22  (via drill 0.25)
  Top 0.127: U1.37 15.89,23.26 16,23.37 v17.27,23.37
  Bottom 0.127: v17.27,23.37 17.4,23.37 19.81,25.78 32.51,25.78 33.27,26.54 J2.P$11
PB23  (via drill 0.25)
  Top 0.127: U1.38 15.39,23.39 15.62,23.62 16.76,23.62 v17.27,24.13
  Bottom 0.127: v17.27,24.13 19.56,26.42 31.62,26.42 J2.P$12
RESETLIN  (1 unrouted)
  Top 0.127: U1.40 14.39,23.98 14.47,24.06 R3.P$2
SAO_3.3V  (via drill 0.25)
  Top 0.254: U4.3 22.16,12.88 | 22.16,12.88 22.16,11.68 22.54,11.3 v27.75,11.3 R5.P$1 | U4.8 28.26,14.18 | 28.26,14.18 28.26,14.61 27.88,14.99 22.54,14.99 22.16,14.61 22.16,12.88 | C7.P$1 28.26,14.18
  Bottom 0.254: v27.75,9.65 v27.75,11.3
  other vias: 29.27,9.65 29.27,6.48 27.75,6.99 27.75,8.26 29.27,8.26
  pour Top (no thermals): 27.43,9.91 29.59,9.91 29.59,6.1 27.43,6.1
SAO_GPIO1  (via drill 0.25)
  Top 0.127: U1.29 19.42,17.41 19.88,16.95 19.88,11.56 21.14,10.29 23.18,10.29 23.43,10.03 SAO.5
  other vias: 22.61,9.65 22.61,8.26 24.26,9.65 24.26,8.26 24.26,6.99 22.61,6.48
  pour Top (no thermals): 22.35,9.91 24.51,9.91 24.51,6.1 22.35,6.1
SAO_GPIO2  (via drill 0.25)
  Top 0.127: U1.24 15.89,12.87 16.57,12.19 18.86,12.19 21.4,9.65 21.4,1.14 21.91,0.64 23.24,0.64 23.43,0.83 SAO.6
  other vias: 22.61,4.45 22.61,2.79 24.26,3.94 24.26,2.79 24.26,1.4 22.61,1.4
  pour Top (no thermals): 22.35,4.83 24.51,4.83 24.51,1.02 22.35,1.02
SAO_SCL  (via drill 0.25)
  Top 0.127: U1.32 19,18.91 20.38,17.53 20.38,11.81 21.4,10.79 30.04,10.79 30.8,10.03 30.8,1.65 29.78,0.64 26.16,0.64 25.97,0.83 SAO.4
  other vias: 25.15,3.94 25.15,2.79 25.15,1.4 26.8,1.4 26.8,2.79 26.8,3.94
  pour Top (no thermals): 24.89,4.83 27.05,4.83 27.05,1.02 24.89,1.02
SAO_SDA  (via drill 0.25)
  Top 0.127: U1.31 19.11,18.41 20.13,17.39 20.13,11.68 21.27,10.54 25.46,10.54 25.97,10.03 SAO.3
  other vias: 25.15,9.65 25.15,8.26 25.15,6.99 26.8,6.99 26.8,8.26 26.8,9.65
  pour Top (no thermals): 24.89,9.91 27.05,9.91 27.05,6.1 24.89,6.1
SHLD  (7 unrouted)
  Top 0.254: L2.P$1 30.3,21.08 30.73,21.52 J1.MT_T_0
SWCLK
  Top 0.127: U1.45 11.89,23.35 11.11,24.13 11.11,26.42 10.22,27.3 4.38,27.3 4,26.92 4,16.38 4.76,15.62 4.76,12.57 TC1.P$4 3.43,11.94 2.79,11.3 2.79,10.29 J4.P$4
SWDIO
  Top 0.127: U1.46 11.39,23.47 10.86,24 10.86,26.29 10.1,27.05 4.51,27.05 4.25,26.8 4.25,17.27 6.79,14.73 6.79,13.34 6.79,11.94 | J4.P$3 4.32,6.22 6.79,8.7 6.79,11.94 | TC1.P$3 6.79,11.94
TPS_ILIM  (1 unrouted)
  Top 0.127: U4.4 23.43,12.23 23.26,12.06 R6.P$1
USB_3.3V
  Top 0.254: U3.P$5 18.42,27.81 C6.P$1 18.44,28.37 | 18.44,28.37 C8.P$1 | 18.44,28.37 21.12,28.37 21.96,29.21 30.92,29.21 31.81,28.32 31.81,13.97 30.73,12.88 30.16,12.88 | 30.16,12.88 U4.6 | C15.P$1 30.16,12.88
USB_VBUS
  Top 0.254: U2.5 24.06,19.2 arc90 23.7,18.83 L1.P$2 23.7,18.33 C5.P$1 C4.P$1 20.85,18.33 20.64,18.54 20.64,22.1 20.38,22.35 20.32,22.35 | 20.32,22.35 18.73,22.35 18.42,22.67 U3.P$1 | U3.P$3 20.32,22.35 | U2.5
USB_VBUS_PORT  (1 unrouted)
  Top 0.254: L1.P$1 23.7,20.52 23.96,20.79 J1.B4/A9 23.96,23.28 24.52,23.84 28.33,23.84 28.86,23.3 J1.A4/B9
VDDCORE
  Top 0.127: U1.43 12.89,23.37 13.14,23.62 C1.P$1
XIN32
  Top 0.127: C2.P$2 9.6,24.65 9.12,24.17 X1.1 7.98,23.16 7.68,22.86 7.68,21.08 7.85,20.91 U1.1
XOUT32
  Top 0.127: 5.92,23.12 X1.4 | C3.P$2 5.39,24.65 5.92,24.12 X1.4 | U1.2 7.72,20.41 7.3,20.83 7.3,22.86 7,23.16 X1.4

### Text on the board
bPlace: A0 | PB23 | A1 | PB22 | A2 | PA12 | A3 | D13 | A4 | D12 | A5 | D11 | D10 | D4 | !RST | D7 | SWCLK | D3 | SWDIO | D2 | 3.3V | D1 | GND | D0